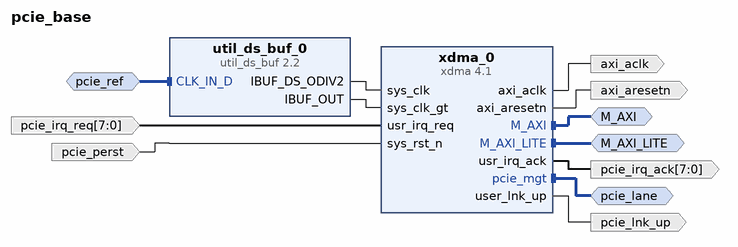
[diagram p0: block diagram of the top level]
# Vivado block design pcie_base, xcvu13p-fhgb2104-2-i, Vivado 2022.2
create_bd_design pcie_base

create_bd_intf_port -mode Slave -vlnv xilinx.com:interface:diff_clock_rtl:1.0 pcie_ref
create_bd_intf_port -mode Master -vlnv xilinx.com:interface:aximm_rtl:1.0 M_AXI
set_property -dict [list \
  CONFIG.ADDR_WIDTH 64 \
  CONFIG.DATA_WIDTH 512 \
  CONFIG.HAS_BURST 0 \
  CONFIG.HAS_QOS 0 \
  CONFIG.HAS_REGION 0 \
  CONFIG.NUM_READ_OUTSTANDING 32 \
  CONFIG.NUM_WRITE_OUTSTANDING 16 \
  CONFIG.PROTOCOL AXI4 \
] [get_bd_intf_ports M_AXI]
create_bd_intf_port -mode Master -vlnv xilinx.com:interface:aximm_rtl:1.0 M_AXI_LITE
set_property -dict [list \
  CONFIG.ADDR_WIDTH 32 \
  CONFIG.DATA_WIDTH 32 \
  CONFIG.HAS_BURST 0 \
  CONFIG.HAS_CACHE 0 \
  CONFIG.HAS_LOCK 0 \
  CONFIG.HAS_QOS 0 \
  CONFIG.HAS_REGION 0 \
  CONFIG.PROTOCOL AXI4LITE \
] [get_bd_intf_ports M_AXI_LITE]
create_bd_intf_port -mode Master -vlnv xilinx.com:interface:pcie_7x_mgt_rtl:1.0 pcie_lane
create_bd_port -dir I -type rst pcie_perst
create_bd_port -dir I -from 7 -to 0 pcie_irq_req
create_bd_port -dir O pcie_lnk_up
create_bd_port -dir O -type clk axi_aclk
create_bd_port -dir O -type rst axi_aresetn
create_bd_port -dir O -from 7 -to 0 pcie_irq_ack

create_bd_cell -type ip -vlnv xilinx.com:ip:xdma:4.1 xdma_0
set_property -dict [list \
  CONFIG.axilite_master_en true \
  CONFIG.cfg_mgmt_if false \
  CONFIG.mcap_enablement Tandem_PCIe \
  CONFIG.mode_selection Basic \
  CONFIG.pl_link_cap_max_link_speed 8.0_GT/s \
  CONFIG.pl_link_cap_max_link_width X16 \
  CONFIG.xdma_num_usr_irq 8 \
  CONFIG.xdma_rnum_chnl 4 \
  CONFIG.xdma_wnum_chnl 4 \
] [get_bd_cells xdma_0]
create_bd_cell -type ip -vlnv xilinx.com:ip:util_ds_buf:2.2 util_ds_buf_0
set_property -dict {CONFIG.C_BUF_TYPE IBUFDSGTE} [get_bd_cells util_ds_buf_0]

# ---- connections ----

connect_bd_intf_net [get_bd_intf_ports pcie_ref] [get_bd_intf_pins util_ds_buf_0/CLK_IN_D]
connect_bd_intf_net [get_bd_intf_ports M_AXI] [get_bd_intf_pins xdma_0/M_AXI]
connect_bd_intf_net [get_bd_intf_ports M_AXI_LITE] [get_bd_intf_pins xdma_0/M_AXI_LITE]
connect_bd_intf_net [get_bd_intf_ports pcie_lane] [get_bd_intf_pins xdma_0/pcie_mgt]
connect_bd_net [get_bd_ports pcie_irq_req] [get_bd_pins xdma_0/usr_irq_req]
connect_bd_net [get_bd_ports pcie_perst] [get_bd_pins xdma_0/sys_rst_n]
connect_bd_net [get_bd_pins util_ds_buf_0/IBUF_DS_ODIV2] [get_bd_pins xdma_0/sys_clk]
connect_bd_net [get_bd_pins util_ds_buf_0/IBUF_OUT] [get_bd_pins xdma_0/sys_clk_gt]
connect_bd_net [get_bd_pins xdma_0/axi_aclk] [get_bd_ports axi_aclk]
connect_bd_net [get_bd_pins xdma_0/axi_aresetn] [get_bd_ports axi_aresetn]
connect_bd_net [get_bd_pins xdma_0/user_lnk_up] [get_bd_ports pcie_lnk_up]
connect_bd_net [get_bd_pins xdma_0/usr_irq_ack] [get_bd_ports pcie_irq_ack]

# ---- address map ----
assign_bd_address -offset 0x0000000000000000 -range 1T -target_address_space [get_bd_addr_spaces xdma_0/M_AXI] [get_bd_addr_segs M_AXI/Reg]
assign_bd_address -offset 0x00000000 -range 4G -target_address_space [get_bd_addr_spaces xdma_0/M_AXI_LITE] [get_bd_addr_segs M_AXI_LITE/Reg]

validate_bd_design
save_bd_design
